# EAGLE design D2Arduino (EAGLE 5.10)
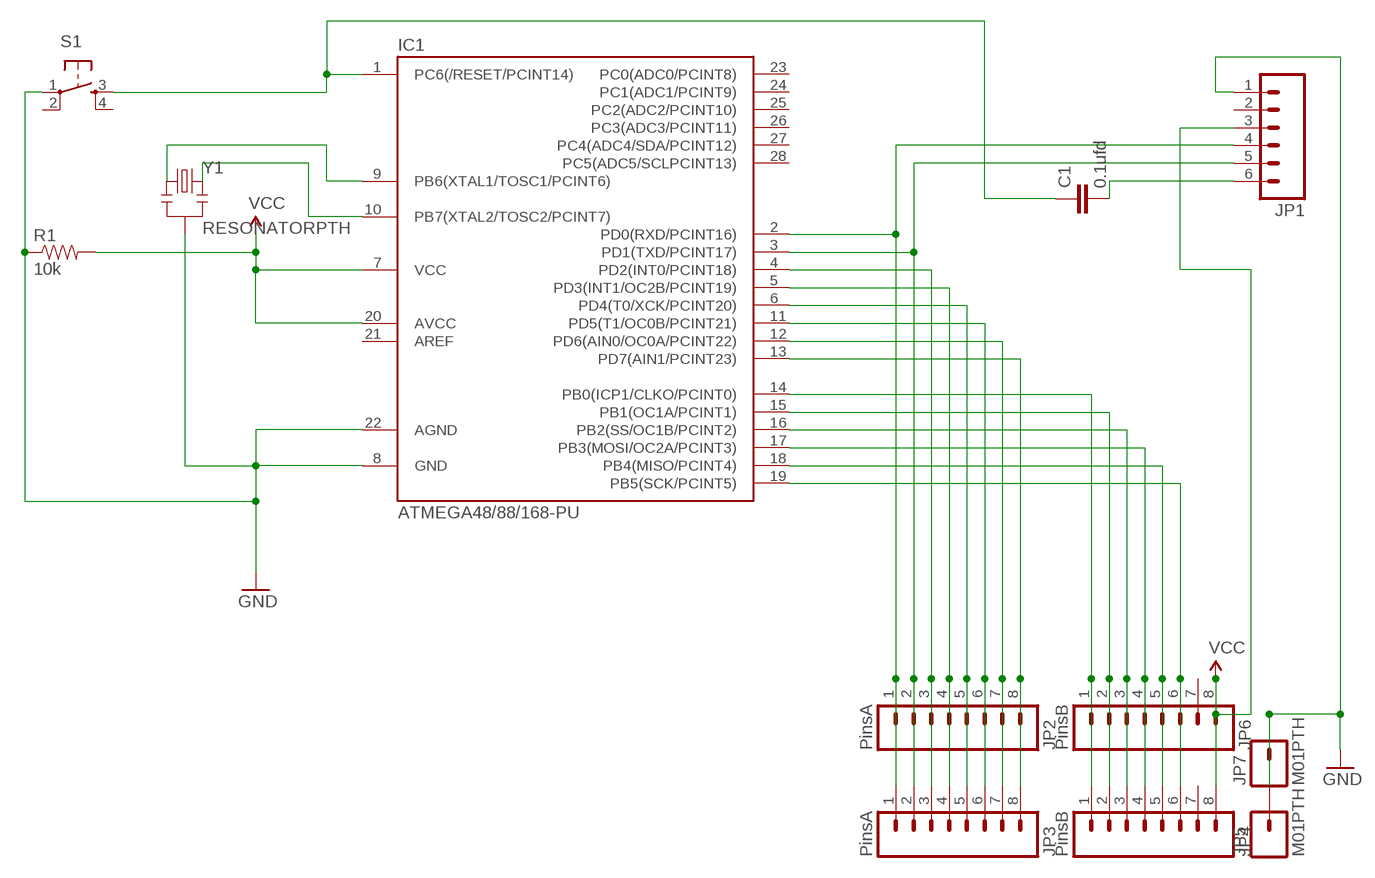
[diagram p0: schematic, sheet 1]

## Parts
C1  0.1ufd  CAPPTH2  [CAP-PTH-SMALL2]
IC1  ATMEGA48/88/168-PU  [DIL28-3]
JP1  M06RA  [MOLEX-1X6-RA]
JP2  PinsA  M08  [1X08]
JP3  PinsA  M08  [1X08]
JP4  PinsB  M08  [1X08]
JP5  M01PTH  [1X01]
JP6  PinsB  M08  [1X08]
JP7  M01PTH  [1X01]
R1  10k  RESISTORPTH-1/6W  [1/6W-RES]
S1  TAC_SWITCHPTH  [TACTILE-PTH]
Y1  RESONATORPTH  [RESONATOR-PTH]

## Nets
GND: IC1.8(GND) IC1.22(AGND) JP1.1 JP5.1 JP7.1 R1.1 S1.1 Y1.2
N$1: IC1.2(PD0(RXD/PCINT16)) JP1.4 JP2.1 JP3.1
N$2: IC1.3(PD1(TXD/PCINT17)) JP1.5 JP2.2 JP3.2
N$3: IC1.4(PD2(INT0/PCINT18)) JP2.3 JP3.3
N$4: IC1.5(PD3(INT1/OC2B/PCINT19)) JP2.4 JP3.4
N$5: IC1.6(PD4(T0/XCK/PCINT20)) JP2.5 JP3.5
N$6: IC1.11(PD5(T1/OC0B/PCINT21)) JP2.6 JP3.6
N$7: IC1.12(PD6(AIN0/OC0A/PCINT22)) JP2.7 JP3.7
N$8: IC1.13(PD7(AIN1/PCINT23)) JP2.8 JP3.8
N$9: IC1.14(PB0(ICP1/CLKO/PCINT0)) JP4.1 JP6.1
N$10: IC1.15(PB1(OC1A/PCINT1)) JP4.2 JP6.2
N$11: IC1.16(PB2(SS/OC1B/PCINT2)) JP4.3 JP6.3
N$12: IC1.17(PB3(MOSI/OC2A/PCINT3)) JP4.4 JP6.4
N$13: IC1.18(PB4(MISO/PCINT4)) JP4.5 JP6.5
N$14: IC1.19(PB5(SCK/PCINT5)) JP4.6 JP6.6
N$15: IC1.9(PB6(XTAL1/TOSC1/PCINT6)) Y1.1
N$16: IC1.10(PB7(XTAL2/TOSC2/PCINT7)) Y1.3
N$18: C1.1 IC1.1(PC6(/RESET/PCINT14)) S1.3
N$20: C1.2 JP1.6
VCC: IC1.7(VCC) IC1.20(AVCC) JP1.3 JP4.8 JP6.8 R1.2
Unconnected: IC1.21(AREF) IC1.23(PC0(ADC0/PCINT8)) IC1.24(PC1(ADC1/PCINT9)) IC1.25(PC2(ADC2/PCINT10)) IC1.26(PC3(ADC3/PCINT11)) IC1.27(PC4(ADC4/SDA/PCINT12)) IC1.28(PC5(ADC5/SCLPCINT13)) JP1.2 JP4.7 JP6.7 S1.2 S1.4

## Library data of the parts
C1 = SparkFun:CAP: Capacitor Standard 0603 ceramic capacitor, and 0.1" leaded capacitor.
IC1 = atmega8:ATMEGA48/88/168-PU
JP1 = SparkFun:M06: Header 6 Standard 6-pin 0.1" header. Use with straight break away headers (SKU : PRT-00116), right angle break away headers (PRT-00553), swiss pins (PRT-00743), machine pins (PRT-00117), and female headers (PRT-00115). Molex polarized connector foot print use with SKU : PRT-08094 with associated crimp pins and housings. NOTES ON THE VARIANTS LOCK and LOCK_LONGPADS... This footprint was designed to help hold the alignment of a through-hole component (i.e. 6-pin header) while soldering it into place. You may notice that each hole has been shifted either up or down by 0.005 of an inch from it's more standard position (which is a perfectly straight line). This slight alteration caused the pins (the squares in the middle) to touch the edges of the holes. Because they are alternating, it causes a "brace" to hold the component in place. 0.005 has proven to be the perfect amount of "off-center" position when using our standard breakaway headers. Although looks a little odd when you look at the bare footprint, once you have a header in there, the alteration is very hard to notice. Also, if you push a header all the way into place, it is covered up entirely on the bottom side. This idea of altering the position of holes to aid alignment will be further integrated into the Sparkfun Library for other footprints. It can help hold any component with 3 or more connection pins.
JP2-JP4 JP6 = SparkFun:M08: Header 8 Standard 8-pin 0.1" header. Use with straight break away headers (SKU : PRT-00116), right angle break away headers (PRT-00553), swiss pins (PRT-00743), machine pins (PRT-00117), and female headers (PRT-00115).
JP5 JP7 = SparkFun:M01: Header 1 Standard 1-pin 0.1" header. Use with straight break away headers (SKU : PRT-00116), right angle break away headers (PRT-00553), swiss pins (PRT-00743), machine pins (PRT-00117), and female headers (PRT-00115).
R1 = SparkFun:RESISTOR: Resistor Basic schematic elements and footprints for 0603, 1206, and PTH 1/10th watt (small) resistors.
S1 = SparkFun:TAC_SWITCH: Momentary Switch Button commonly used for reset or general input. Spark Fun Electronics SKU : COM-00097
Y1 = SparkFun:RESONATOR: Resonator Small SMD resonator. This is the itty bitty 10/20MHz resonators with built in caps. CSTCE10M0G55 and CSTCE20M0V53. Footprint has been reviewed closely but hasn't been tested yet.

## Board
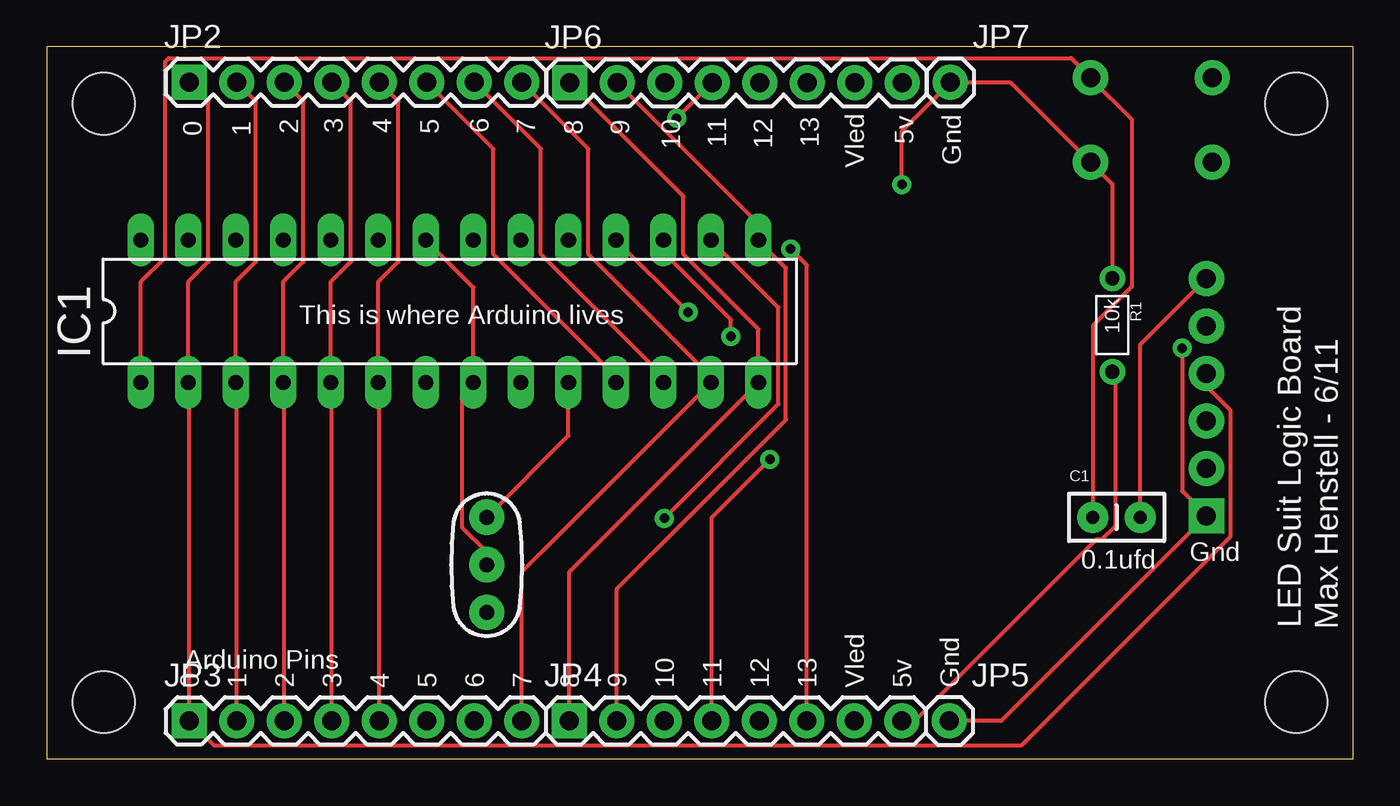
[diagram p1: board, top side]
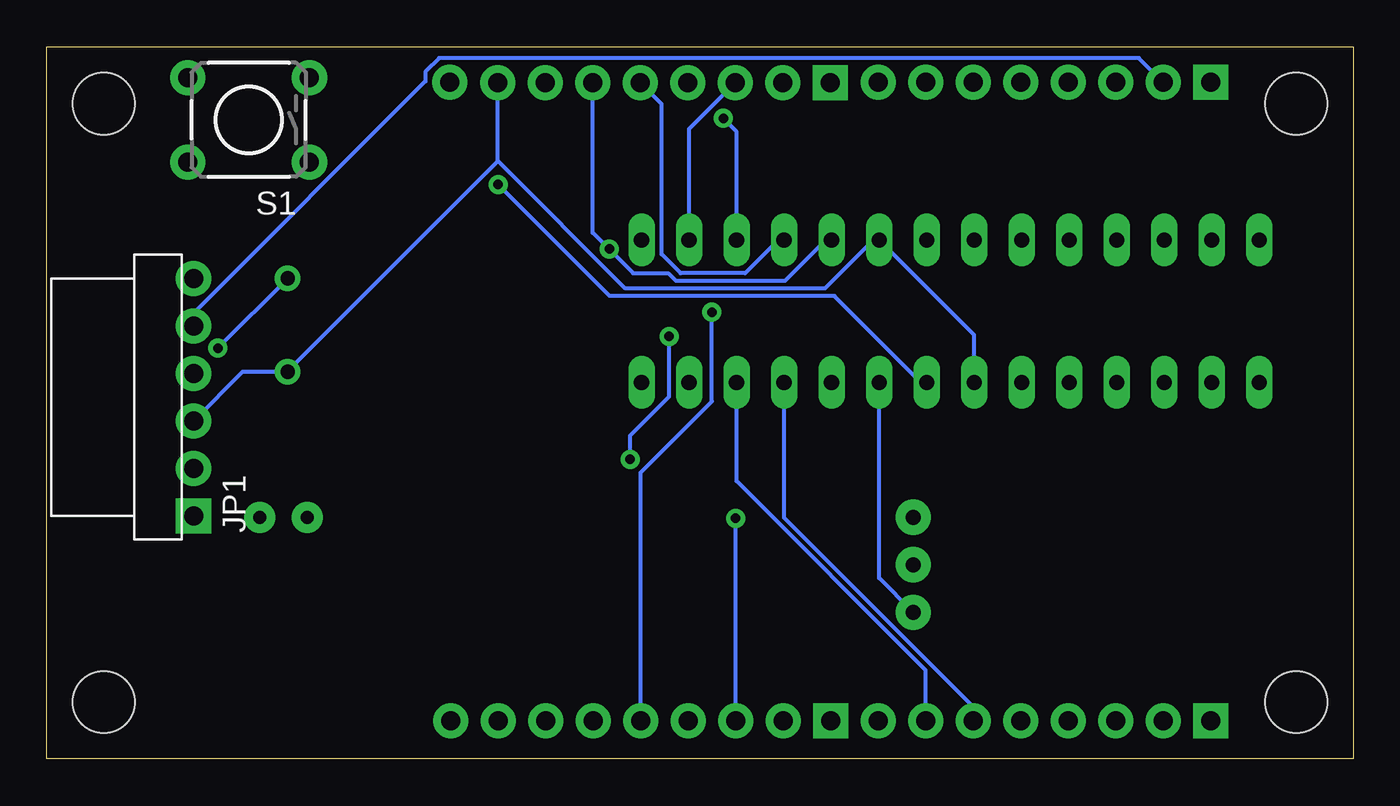
[diagram p2: board, bottom side, seen from below]

Size 69.85 x 38.1 mm. Coordinates in mm from the lower left corner, seen from the top.
Outline: 0,0 69.85,0 69.85,38.1 0,38.1 0,0
Copper layers (1*16): Top 0.035mm / dielectric 1.5mm / Bottom 0.035mm
Design rules "SparkFun": minimum track width 8mil, minimum drill 20mil, track to track 8mil, track to pad 8mil, pad to pad 8mil, via to via 8mil, smd to smd 8mil, copper to edge 10mil, drill to drill 8mil, minimum pad ring 12mil, minimum via ring 10mil, stop-mask expansion 4mil, vias tented up to drill 25mil, thermal gap 10mil

### Footprints (pad centres in the part's own frame; a part is rotated, then mirrored left to right if it is on the bottom)
CAP-PTH-SMALL2 = drill 0.7 pad 1.651 round: 1 0,0; 2 2.54,0
DIL28-3 = drill 0.813 long: 1 -16.51,-3.81; 2 -13.97,-3.81; 3 -11.43,-3.81; 4 -8.89,-3.81; 5 -6.35,-3.81; 6 -3.81,-3.81; 7 -1.27,-3.81; 8 1.27,-3.81; 9 3.81,-3.81; 10 6.35,-3.81; 11 8.89,-3.81; 12 11.43,-3.81; 13 13.97,-3.81; 14 16.51,-3.81; 15 16.51,3.81; 16 13.97,3.81; 17 11.43,3.81; 18 8.89,3.81; 19 6.35,3.81; 20 3.81,3.81; 21 1.27,3.81; 22 -1.27,3.81; 23 -3.81,3.81; 24 -6.35,3.81; 25 -8.89,3.81; 26 -11.43,3.81; 27 -13.97,3.81; 28 -16.51,3.81
MOLEX-1X6-RA = drill 1.016 pad 1.88 square: 1 0,0 | drill 1.016 pad 1.88 round: 2 2.54,0; 3 5.08,0; 4 7.62,0; 5 10.16,0; 6 12.7,0
1X08 = drill 1.016 pad 1.88 square: 1 0,0 | drill 1.016 pad 1.88 round: 2 2.54,0; 3 5.08,0; 4 7.62,0; 5 10.16,0; 6 12.7,0; 7 15.24,0; 8 17.78,0
1X01 = drill 1.016 pad 1.88 round: 1 0,0
1/6W-RES = drill 0.762 round: 1 -2.5,0; 2 2.5,0
TACTILE-PTH = drill 1.016 pad 1.88 round: 1 -3.251,2.261; 2 3.251,2.261; 3 -3.251,-2.261; 4 3.251,-2.261
STAND-OFF = hole 3.302: 0,0
RESONATOR-PTH = drill 0.8 pad 1.88 round: 1 -2.54,0; 2 0,0; 3 2.54,0

### Placement (x,y rotation side)
C1  55.93,12.93 0 top
IC1  21.54,23.95 0 top
JP1  62,13 90 bottom
JP2  7.62,36.2 0 top
JP3  7.62,2.03 0 top
JP4  27.94,2.03 0 top
JP5  48.26,2.03 0 top
JP6  27.97,36.17 0 top
JP7  48.31,36.2 0 top
R1  56.97,23.22 270 top
S1  59.05,34.19 180 bottom
U$17  [STAND-OFF]  3.05,3.05 0 top
U$18  [STAND-OFF]  3.05,35.05 0 top
U$19  [STAND-OFF]  66.8,35.05 0 top
U$20  [STAND-OFF]  66.8,3.05 0 top
Y1  23.52,10.39 90 top

### Tracks (layer width: path | path; a pad name or v marks a point on that pad's centre or on a via)
GND  (via drill 0.51)
  Top 0.203: IC1.22 22.81,25.22 IC1.8 22.76,20.07 22.23,19.53 22.23,12.37 23.52,11.07 Y1.2 | R1.1 56.97,30.76 S1.1 55.73,31.98 51.51,36.2 JP7.1 48.26,36.12 45.72,33.58 v45.72,30.73 | JP5.1 51.03,2.03 JP1.1 61.95,13.08 60.71,14.33 v60.71,21.97
  Bottom 0.203: v60.71,21.97 56.97,25.7 R1.1 | IC1.8 23.11,20.14 27.74,24.77 39.75,24.77 v45.72,30.73
N$1
  Top 0.203: JP2.1 8.64,35.18 8.64,26.59 7.57,25.53 IC1.2 7.62,20.07 JP3.1 7.7,1.98 8.94,0.74 52.12,0.74 63.3,11.91 63.3,18.64 62,19.94 JP1.4
N$2
  Top 0.203: JP2.2 11.18,35.18 11.18,26.59 10.11,25.53 IC1.3 10.16,20.07 JP3.2
  Bottom 0.203: JP1.5 62,23.85 49.61,36.25 49.61,36.75 48.87,37.49 11.46,37.49 JP2.2
N$3
  Top 0.203: JP2.3 13.72,35.18 13.72,26.59 12.65,25.53 IC1.4 12.7,20.07 JP3.3
N$4
  Top 0.203: JP2.4 16.26,35.18 16.26,26.59 15.19,25.53 IC1.5 15.24,20.07 JP3.4
N$5
  Top 0.203: JP2.5 18.8,35.18 18.8,26.59 17.73,25.53 IC1.6 17.78,20.07 JP3.5
N$6
  Top 0.203: IC1.11 30.43,20.45 23.88,27 23.88,32.64 JP2.6
  Bottom 0.203: JP3.6 20.32,2.79 30.43,12.9 IC1.11
N$7
  Top 0.203: IC1.12 32.97,20.45 26.42,27 26.42,32.64 JP2.7
  Bottom 0.203: JP3.7 22.86,4.75 32.97,14.86 IC1.12
N$8
  Top 0.203: JP2.8 28.96,32.64 28.96,27 35.51,20.45 IC1.13 35.46,20.07 25.4,10.01 JP3.8
N$9
  Top 0.203: JP6.1 34.04,30.1 34.04,27 38.05,22.99 IC1.14 38,20.07 27.94,10.01 JP4.1
N$10
  Top 0.203: JP6.2 38.05,28.63 IC1.15 38.1,27.69 39.52,26.26 39.52,18.14 30.48,9.09 JP4.2
N$11  (via drill 0.51)
  Top 0.203: v33.02,12.88 39.12,18.97 39.12,24.16 IC1.16
  Bottom 0.203: IC1.16 35.51,33.71 JP6.3 | JP4.3 v33.02,12.88
N$12  (via drill 0.51)
  Top 0.203: v33.68,34.27 JP6.4 | JP4.4 35.56,12.93 v38.66,16.03 | v36.58,22.61 36.58,23.5 32.97,27.1 IC1.17
  Bottom 0.203: IC1.17 32.97,33.55 v33.68,34.27 | v38.66,16.03 38.66,17.3 36.58,19.38 v36.58,22.61
N$13  (via drill 0.51)
  Top 0.203: v34.29,23.9 IC1.18
  Bottom 0.203: IC1.18 30.73,27.76 32.51,25.98 35.97,25.98 36.98,27 36.98,35.03 JP6.5 | JP4.5 38.1,15.32 34.29,19.13 v34.29,23.9
N$14  (via drill 0.51)
  Top 0.203: JP4.6 40.64,26.42 v39.78,27.28
  Bottom 0.203: IC1.19 28.19,27.76 30.38,25.58 36.22,25.58 36.63,25.98 38.51,25.98 39.79,27.27 | 39.79,27.27 40.66,28.14 JP6.6 | v39.78,27.28 39.79,27.27
N$15
  Bottom 0.203: IC1.9 25.35,9.68 Y1.1
N$16
  Top 0.203: IC1.10 27.89,17.3 Y1.3
N$18
  Top 0.203: IC1.1 5.03,25.53 6.33,26.82 6.33,37.29 6.53,37.49 54.76,37.49 S1.3 55.85,36.37 58.01,34.21 58.01,25.27 55.93,23.19 C1.1
N$20
  Top 0.203: C1.2 58.47,22.17 JP1.6
VCC
  Top 0.203: JP4.8 46.41,2.03 56.11,11.73 56.41,11.73 57.12,12.45 57.12,20.55 56.97,20.7 R1.2
  Bottom 0.203: IC1.7 20.27,22.68 IC1.20 25.43,27.71 25.7,27.71 28.25,25.17 38.91,25.17 45.67,31.93 45.74,31.98 | JP1.3 59.38,20.7 56.97,20.7 R1.2 56.92,20.8 45.74,31.98 | 45.74,31.98 JP6.8

### Text on the board
tPlace: Vled | 0 | 1 | 2 | 3 | 4 | 5 | 6 | 7 | 8 | 9 | 10 | 11 | 12 | 13 | 5v | Gnd | This is where Arduino lives | Gnd | 0.1ufd | LED Suit Logic Board | Max Henstell - 6/11 | Arduino Pins | 0 | 1 | 2 | 3 | 4 | 5 | 6 | 7 | 8 | 9 | 10 | 11 | 12 | 13 | Vled | 5v | Gnd